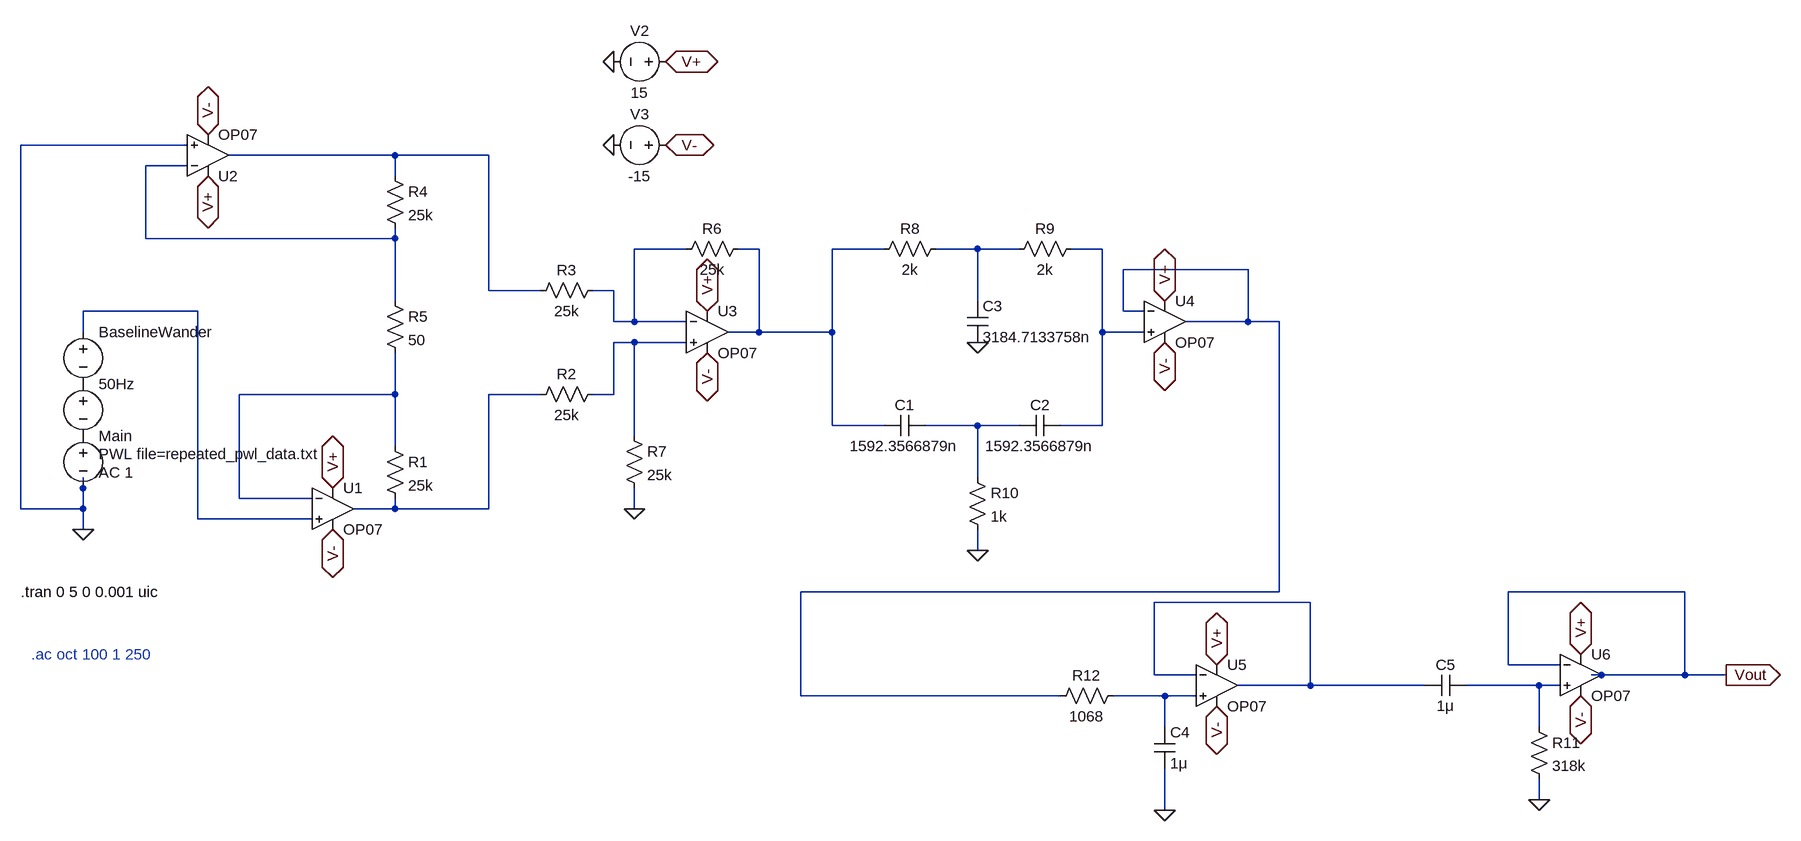
[diagram p0: schematic ECG circuit.asc]
ECG circuit.asc, the LTspice schematic file:
Version 4
SHEET 1 2436 680
WIRE -96 -1024 -352 -1024
WIRE 224 -1008 -32 -1008
WIRE 368 -1008 224 -1008
WIRE -96 -992 -160 -992
WIRE 224 -976 224 -1008
WIRE -160 -880 -160 -992
WIRE 224 -880 224 -896
WIRE 224 -880 -160 -880
WIRE 672 -864 592 -864
WIRE 784 -864 752 -864
WIRE 976 -864 896 -864
WIRE 1120 -864 1056 -864
WIRE 1184 -864 1120 -864
WIRE 1312 -864 1264 -864
WIRE 1536 -832 1344 -832
WIRE 368 -800 368 -1008
WIRE 448 -800 368 -800
WIRE 560 -800 528 -800
WIRE 224 -784 224 -880
WIRE 1120 -784 1120 -864
WIRE -80 -768 -256 -768
WIRE 1344 -768 1344 -832
WIRE 1376 -768 1344 -768
WIRE 560 -752 560 -800
WIRE 592 -752 592 -864
WIRE 592 -752 560 -752
WIRE 672 -752 592 -752
WIRE 1536 -752 1536 -832
WIRE 1536 -752 1440 -752
WIRE 1584 -752 1536 -752
WIRE -256 -736 -256 -768
WIRE 784 -736 784 -864
WIRE 784 -736 736 -736
WIRE 896 -736 896 -864
WIRE 896 -736 784 -736
WIRE 1312 -736 1312 -864
WIRE 1376 -736 1312 -736
WIRE 592 -720 560 -720
WIRE 672 -720 592 -720
WIRE 224 -640 224 -704
WIRE 224 -640 -16 -640
WIRE 448 -640 368 -640
WIRE 560 -640 560 -720
WIRE 560 -640 528 -640
WIRE 896 -592 896 -736
WIRE 976 -592 896 -592
WIRE 1120 -592 1040 -592
WIRE 1184 -592 1120 -592
WIRE 1312 -592 1312 -736
WIRE 1312 -592 1248 -592
WIRE 592 -576 592 -720
WIRE 224 -560 224 -640
WIRE 1120 -512 1120 -592
WIRE -256 -496 -256 -512
WIRE -16 -480 -16 -640
WIRE 96 -480 -16 -480
WIRE -352 -464 -352 -1024
WIRE -256 -464 -256 -496
WIRE -256 -464 -352 -464
WIRE 224 -464 224 -480
WIRE 224 -464 160 -464
WIRE 368 -464 368 -640
WIRE 368 -464 224 -464
WIRE 592 -464 592 -496
WIRE -80 -448 -80 -768
WIRE 96 -448 -80 -448
WIRE -256 -432 -256 -464
WIRE 1120 -400 1120 -432
WIRE 1584 -336 1584 -752
WIRE 1584 -336 848 -336
WIRE 2208 -336 1936 -336
WIRE 1632 -320 1392 -320
WIRE 1936 -224 1936 -336
WIRE 2016 -224 1936 -224
WIRE 1392 -208 1392 -320
WIRE 1456 -208 1392 -208
WIRE 2080 -208 2064 -208
WIRE 2208 -208 2208 -336
WIRE 2208 -208 2080 -208
WIRE 2272 -208 2208 -208
WIRE 1632 -192 1632 -320
WIRE 1632 -192 1520 -192
WIRE 1808 -192 1632 -192
WIRE 1984 -192 1872 -192
WIRE 2016 -192 1984 -192
WIRE 848 -176 848 -336
WIRE 1248 -176 848 -176
WIRE 1408 -176 1328 -176
WIRE 1456 -176 1408 -176
WIRE 1408 -128 1408 -176
WIRE 1984 -128 1984 -192
WIRE 1984 -16 1984 -48
WIRE 1408 0 1408 -64
FLAG -256 -432 0
FLAG 592 -464 0
FLAG 704 -768 V+
IOPIN 704 -768 BiDir
FLAG -64 -976 V+
IOPIN -64 -976 BiDir
FLAG 128 -496 V+
IOPIN 128 -496 BiDir
FLAG -64 -1040 V-
IOPIN -64 -1040 BiDir
FLAG 128 -432 V-
IOPIN 128 -432 BiDir
FLAG 704 -704 V-
IOPIN 704 -704 BiDir
FLAG 640 -1152 V+
IOPIN 640 -1152 BiDir
FLAG 560 -1152 0
FLAG 640 -1024 V-
IOPIN 640 -1024 BiDir
FLAG 560 -1024 0
FLAG 1120 -720 0
FLAG 1120 -400 0
FLAG 1408 -784 V+
IOPIN 1408 -784 BiDir
FLAG 1408 -720 V-
IOPIN 1408 -720 BiDir
FLAG 1408 0 0
FLAG 1984 -16 0
FLAG 2272 -208 Vout
IOPIN 2272 -208 Out
FLAG 1488 -224 V+
IOPIN 1488 -224 BiDir
FLAG 2048 -240 V+
IOPIN 2048 -240 BiDir
FLAG 1488 -160 V-
IOPIN 1488 -160 BiDir
FLAG 2048 -176 V-
IOPIN 2048 -176 BiDir
SYMBOL OpAmps\\OP07 128 -528 R0
SYMATTR InstName U1
SYMBOL res 208 -576 R0
SYMATTR InstName R1
SYMATTR Value 25k
SYMBOL res 544 -656 R90
WINDOW 0 0 56 VBottom 2
WINDOW 3 32 56 VTop 2
SYMATTR InstName R2
SYMATTR Value 25k
SYMBOL res 544 -816 R90
WINDOW 0 0 56 VBottom 2
WINDOW 3 32 56 VTop 2
SYMATTR InstName R3
SYMATTR Value 25k
SYMBOL res 208 -992 R0
SYMATTR InstName R4
SYMATTR Value 25k
SYMBOL res 208 -800 R0
SYMATTR InstName R5
SYMATTR Value 50
SYMBOL res 768 -880 R90
WINDOW 0 0 56 VBottom 2
WINDOW 3 32 56 VTop 2
SYMATTR InstName R6
SYMATTR Value 25k
SYMBOL res 576 -592 R0
SYMATTR InstName R7
SYMATTR Value 25k
SYMBOL OpAmps\\OP07 704 -800 R0
SYMATTR InstName U3
SYMBOL OpAmps\\OP07 -64 -944 M180
SYMATTR InstName U2
SYMBOL voltage 656 -1152 R90
WINDOW 0 -32 56 VBottom 2
WINDOW 3 32 56 VTop 2
SYMATTR InstName V2
SYMATTR Value 15
SYMBOL voltage 656 -1024 R90
WINDOW 0 -32 56 VBottom 2
WINDOW 3 32 56 VTop 2
SYMATTR InstName V3
SYMATTR Value -15
SYMBOL res 1072 -880 R90
WINDOW 0 0 56 VBottom 2
WINDOW 3 32 56 VTop 2
SYMATTR InstName R8
SYMATTR Value 2k
SYMBOL res 1280 -880 R90
WINDOW 0 0 56 VBottom 2
WINDOW 3 32 56 VTop 2
SYMATTR InstName R9
SYMATTR Value 2k
SYMBOL cap 1040 -608 R90
WINDOW 0 0 32 VBottom 2
WINDOW 3 32 32 VTop 2
SYMATTR InstName C1
SYMATTR Value 1592.3566879n
SYMBOL cap 1248 -608 R90
WINDOW 0 0 32 VBottom 2
WINDOW 3 32 32 VTop 2
SYMATTR InstName C2
SYMATTR Value 1592.3566879n
SYMBOL cap 1104 -784 R0
SYMATTR InstName C3
SYMATTR Value 3184.7133758n
SYMBOL res 1104 -528 R0
SYMATTR InstName R10
SYMATTR Value 1k
SYMBOL OpAmps\\OP07 1408 -816 R0
SYMATTR InstName U4
SYMBOL voltage -256 -592 R0
WINDOW 3 24 44 Left 2
WINDOW 123 24 72 Left 2
WINDOW 39 0 0 Left 0
SYMATTR Value PWL file=repeated_pwl_data.txt
SYMATTR InstName Main
SYMATTR Value2 AC 1
SYMBOL voltage -256 -672 R0
WINDOW 3 24 44 Invisible 2
WINDOW 123 0 0 Left 0
WINDOW 39 0 0 Left 0
SYMATTR Value SINE(0 0.1m 50)
SYMATTR InstName 50Hz
SYMBOL voltage -256 -752 R0
WINDOW 3 24 96 Invisible 2
WINDOW 123 0 0 Left 0
WINDOW 39 0 0 Left 0
SYMATTR Value SINE(0 1m 0.1)
SYMATTR InstName BaselineWander
SYMBOL OpAmps\\OP07 1488 -256 R0
SYMATTR InstName U5
SYMBOL OpAmps\\OP07 2048 -272 R0
SYMATTR InstName U6
SYMBOL res 1968 -144 R0
SYMATTR InstName R11
SYMATTR Value 318k
SYMBOL res 1344 -192 R90
WINDOW 0 0 56 VBottom 2
WINDOW 3 32 56 VTop 2
SYMATTR InstName R12
SYMATTR Value 1068
SYMBOL cap 1392 -128 R0
SYMATTR InstName C4
SYMATTR Value 1μ
SYMBOL cap 1872 -208 R90
WINDOW 0 0 32 VBottom 2
WINDOW 3 32 32 VTop 2
SYMATTR InstName C5
SYMATTR Value 1μ
TEXT -352 -336 Left 2 !.tran 0 5 0 0.001 uic
TEXT -336 -240 Left 2 ;.ac oct 100 1 250

The netlist it stands for:
* ECG circuit.asc
XU1 N008 N010 V+ V- N011 LT1001  ; OP07, pins In+ In- V+ V- OUT
R1 N010 N011 25k
R2 N009 N011 25k
R3 N003 N001 25k
R4 N001 N002 25k
R5 N002 N010 50
R6 N004 N003 25k
R7 N009 0 25k
XU3 N009 N003 V+ V- N004 LT1001  ; OP07, pins In+ In- V+ V- OUT
XU2 0 N002 V+ V- N001 LT1001  ; OP07, pins In+ In- V+ V- OUT
V2 V+ 0 15
V3 V- 0 -15
R8 N005 N004 2k
R9 N006 N005 2k
C1 N012 N004 1592.3566879n
C2 N006 N012 1592.3566879n
C3 N005 0 3184.7133758n
R10 N012 0 1k
XU4 N006 N007 V+ V- N007 LT1001  ; OP07, pins In+ In- V+ V- OUT
V§Main P001 0 PWL file=repeated_pwl_data.txt AC 1
V§50Hz P002 P001 SINE(0 0.1m 50)
V§BaselineWander N008 P002 SINE(0 1m 0.1)
XU5 N015 N013 V+ V- N013 LT1001  ; OP07, pins In+ In- V+ V- OUT
XU6 N014 Vout V+ V- Vout LT1001  ; OP07, pins In+ In- V+ V- OUT
R11 N014 0 318k
R12 N015 N007 1068
C4 N015 0 1μ
C5 N014 N013 1μ
.tran 0 5 0 0.001 uic
* .ac oct 100 1 250
.lib LTC.lib
.backanno
.end